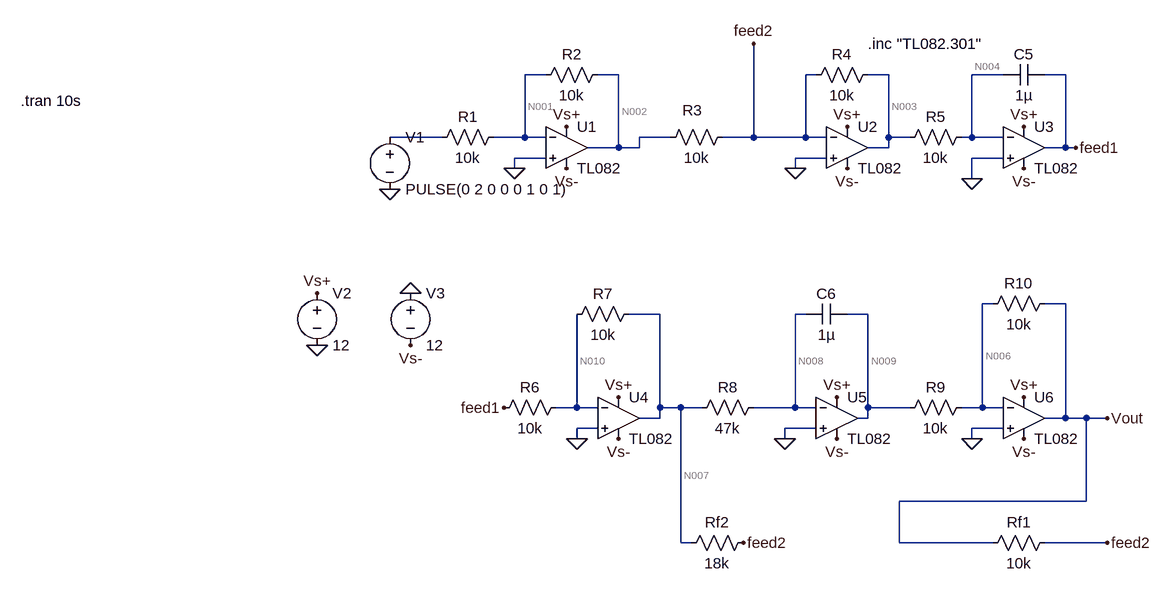
[diagram p0: schematic simulacion_spice.asc]
simulacion_spice.asc, the LTspice schematic file:
Version 4
SHEET 1 880 764
WIRE -384 -16 -416 -16
WIRE -272 -16 -304 -16
WIRE 32 -16 16 -16
WIRE 144 -16 112 -16
WIRE 320 -16 272 -16
WIRE 416 -16 384 -16
WIRE -544 80 -624 80
WIRE -416 80 -416 -16
WIRE -416 80 -464 80
WIRE -384 80 -416 80
WIRE -192 80 -240 80
WIRE -64 80 -64 -64
WIRE -64 80 -112 80
WIRE 16 80 16 -16
WIRE 16 80 -64 80
WIRE 48 80 16 80
WIRE 144 80 144 -16
WIRE 176 80 144 80
WIRE 272 80 272 -16
WIRE 272 80 256 80
WIRE 320 80 272 80
WIRE -272 96 -272 -16
WIRE -272 96 -320 96
WIRE -240 96 -240 80
WIRE -240 96 -272 96
WIRE 144 96 144 80
WIRE 144 96 112 96
WIRE 416 96 416 -16
WIRE 416 96 384 96
WIRE 432 96 416 96
WIRE -384 112 -432 112
WIRE 48 112 0 112
WIRE 320 112 272 112
WIRE -432 128 -432 112
WIRE 0 128 0 112
WIRE 272 144 272 112
WIRE 304 336 288 336
WIRE 416 336 384 336
WIRE -208 352 -256 352
WIRE 16 352 0 352
WIRE 112 352 80 352
WIRE -336 496 -336 352
WIRE -336 496 -368 496
WIRE -304 496 -336 496
WIRE -208 496 -208 352
WIRE -176 496 -208 496
WIRE -144 496 -176 496
WIRE 0 496 0 352
WIRE 0 496 -64 496
WIRE 32 496 0 496
WIRE 112 496 112 352
WIRE 176 496 112 496
WIRE 288 496 288 336
WIRE 288 496 256 496
WIRE 320 496 288 496
WIRE -208 512 -208 496
WIRE -208 512 -240 512
WIRE 112 512 112 496
WIRE 112 512 96 512
WIRE 416 512 416 336
WIRE 416 512 384 512
WIRE 448 512 416 512
WIRE 480 512 448 512
WIRE -304 528 -336 528
WIRE 32 528 -16 528
WIRE 320 528 272 528
WIRE -336 544 -336 528
WIRE -16 544 -16 528
WIRE 272 544 272 528
WIRE 448 640 448 512
WIRE 448 640 160 640
WIRE -176 704 -176 496
WIRE -160 704 -176 704
WIRE 160 704 160 640
WIRE 304 704 160 704
WIRE 480 704 384 704
FLAG -336 544 0
FLAG -16 544 0
FLAG 272 544 0
FLAG 0 128 0
FLAG 272 144 0
FLAG -432 128 0
FLAG -624 160 0
FLAG -80 704 feed2
FLAG -448 496 feed1
FLAG -592 320 0
FLAG -736 400 0
FLAG -736 320 Vs+
FLAG -592 400 Vs-
FLAG -272 544 Vs-
FLAG 352 544 Vs-
FLAG 352 128 Vs-
FLAG 80 128 Vs-
FLAG -352 128 Vs-
FLAG 64 544 Vs-
FLAG -352 64 Vs+
FLAG 80 64 Vs+
FLAG 352 64 Vs+
FLAG 352 480 Vs+
FLAG 64 480 Vs+
FLAG -272 480 Vs+
FLAG 480 512 Vout
FLAG -64 -64 feed2
FLAG 480 704 feed2
FLAG 432 96 feed1
SYMBOL res -288 -32 R90
WINDOW 0 0 56 VBottom 2
WINDOW 3 32 56 VTop 2
SYMATTR InstName R2
SYMATTR Value 10k
SYMBOL res -448 64 R90
WINDOW 0 0 56 VBottom 2
WINDOW 3 32 56 VTop 2
SYMATTR InstName R1
SYMATTR Value 10k
SYMBOL res 128 -32 R90
WINDOW 0 0 56 VBottom 2
WINDOW 3 32 56 VTop 2
SYMATTR InstName R4
SYMATTR Value 10k
SYMBOL res -96 64 R90
WINDOW 0 -10 62 VBottom 2
WINDOW 3 32 56 VTop 2
SYMATTR InstName R3
SYMATTR Value 10k
SYMBOL res 272 480 R90
WINDOW 0 0 56 VBottom 2
WINDOW 3 32 56 VTop 2
SYMATTR InstName R9
SYMATTR Value 10k
SYMBOL res 400 320 R90
WINDOW 0 0 56 VBottom 2
WINDOW 3 32 56 VTop 2
SYMATTR InstName R10
SYMATTR Value 10k
SYMBOL res -48 480 R90
WINDOW 0 0 56 VBottom 2
WINDOW 3 32 56 VTop 2
SYMATTR InstName R8
SYMATTR Value 47k
SYMBOL res -352 480 R90
WINDOW 0 0 56 VBottom 2
WINDOW 3 32 56 VTop 2
SYMATTR InstName R6
SYMATTR Value 10k
SYMBOL res -240 336 R90
WINDOW 0 0 56 VBottom 2
WINDOW 3 32 56 VTop 2
SYMATTR InstName R7
SYMATTR Value 10k
SYMBOL cap 80 336 R90
WINDOW 0 0 32 VBottom 2
WINDOW 3 32 32 VTop 2
SYMATTR InstName C6
SYMATTR Value 1µ
SYMBOL cap 384 -32 R90
WINDOW 0 0 32 VBottom 2
WINDOW 3 32 32 VTop 2
SYMATTR InstName C5
SYMATTR Value 1µ
SYMBOL res 272 64 R90
WINDOW 0 0 56 VBottom 2
WINDOW 3 32 56 VTop 2
SYMATTR InstName R5
SYMATTR Value 10k
SYMBOL res -64 688 R90
WINDOW 0 0 56 VBottom 2
WINDOW 3 32 56 VTop 2
SYMATTR InstName Rf2
SYMATTR Value 18k
SYMBOL Opamps\\opamp2 -352 32 R0
SYMATTR InstName U1
SYMATTR Value TL082
SYMBOL Opamps\\opamp2 80 32 R0
SYMATTR InstName U2
SYMATTR Value TL082
SYMBOL Opamps\\opamp2 352 32 R0
SYMATTR InstName U3
SYMATTR Value TL082
SYMBOL Opamps\\opamp2 -272 448 R0
SYMATTR InstName U4
SYMATTR Value TL082
SYMBOL Opamps\\opamp2 352 448 R0
SYMATTR InstName U6
SYMATTR Value TL082
SYMBOL voltage -736 304 R0
SYMATTR InstName V2
SYMATTR Value 12
SYMBOL voltage -592 304 R0
SYMATTR InstName V3
SYMATTR Value 12
SYMBOL Opamps\\opamp2 64 448 R0
SYMATTR InstName U5
SYMATTR Value TL082
SYMBOL res 400 688 R90
WINDOW 0 0 56 VBottom 2
WINDOW 3 32 56 VTop 2
SYMATTR InstName Rf1
SYMATTR Value 10k
SYMBOL voltage -624 64 R0
WINDOW 123 0 0 Left 2
WINDOW 39 0 0 Left 2
SYMATTR InstName V1
SYMATTR Value PULSE(0 2 0 0 0 1 0 1)
TEXT 112 -64 Left 2 !.inc "TL082.301"
TEXT -1192 24 Left 2 !.tran 10s

The netlist it stands for:
* simulacion_spice.asc
R2 N002 N001 10k
R1 N001 N005 10k
R4 N003 feed2 10k
R3 feed2 N002 10k
R9 N006 N009 10k
R10 Vout N006 10k
R8 N008 N007 47k
R6 N010 feed1 10k
R7 N007 N010 10k
C6 N009 N008 1µ
C5 feed1 N004 1µ
R5 N004 N003 10k
Rf2 feed2 N007 18k
XU1 0 N001 Vs+ Vs- N002 TL082  ; pins In+ In- V+ V- OUT
XU2 0 feed2 Vs+ Vs- N003 TL082  ; pins In+ In- V+ V- OUT
XU3 0 N004 Vs+ Vs- feed1 TL082  ; pins In+ In- V+ V- OUT
XU4 0 N010 Vs+ Vs- N007 TL082  ; pins In+ In- V+ V- OUT
XU6 0 N006 Vs+ Vs- Vout TL082  ; pins In+ In- V+ V- OUT
V2 Vs+ 0 12
V3 0 Vs- 12
XU5 0 N008 Vs+ Vs- N009 TL082  ; pins In+ In- V+ V- OUT
Rf1 feed2 Vout 10k
V1 N005 0 PULSE(0 2 0 0 0 1 0 1)
.inc "TL082.301"
.tran 10s
.backanno
.end

* Results of the author's LTspice run, read from the files saved beside the schematic
* Operating Point, zero values left out:
*   V(n002) = 22.36 µV
*   V(n001) = 10.97 µV
*   V(n003) = 11.39 µV
*   V(feed2) = 10.97 µV
*   V(n006) = 10.97 µV
*   V(n009) = 23.77 µV
*   V(vout) = -1.409 µV
*   V(n008) = 10.97 µV
*   V(n007) = 12.95 µV
*   V(n010) = 10.97 µV
*   V(feed1) = 9.415 µV
*   V(n004) = 10.97 µV
*   V(vs-) = -12 V
*   V(vs+) = 12 V
*   I(Rf1) = 1.238 nA
*   I(Rf2) = -98.82 pA
*   I(R5) = -42.05 pA
*   I(R7) = 197.6 pA
*   I(R6) = 155.6 pA
*   I(R8) = -42.05 pA
*   I(R10) = -1.238 nA
*   I(R9) = -1.28 nA
*   I(R3) = -1.139 nA
*   I(R4) = 42.05 pA
*   I(R1) = 1.097 nA
*   I(R2) = 1.139 nA
*   I(V1) = 1.097 nA
*   I(V3) = -68.37 mA
*   I(V2) = -68.37 mA
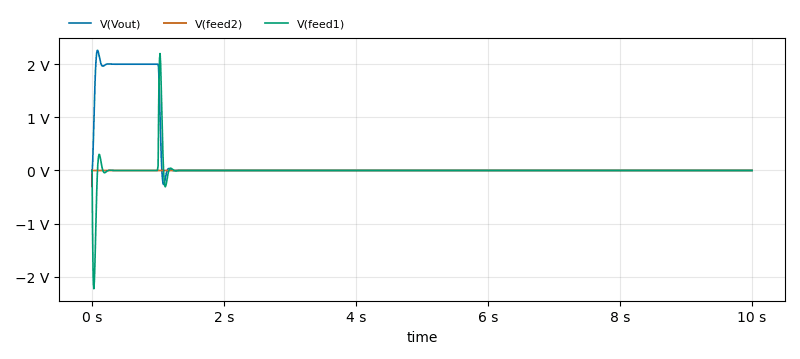
[diagram p1: Transient Analysis of simulacion_spice.asc, plotted from the saved traces]
* Transient Analysis, 1 run:
*   V(Vout): min -264.8 mV, max 2.26 V, average 200.2 mV, rms 631.6 mV, last -1.409 µV
*   V(feed2): min -309.3 mV, max 4.115 mV, average 10.98 µV, rms 46.45 µV, last 11 µV
*   V(feed1): min -2.227 V, max 2.201 V, average -31.34 µV, rms 190.4 mV, last 9.414 µV